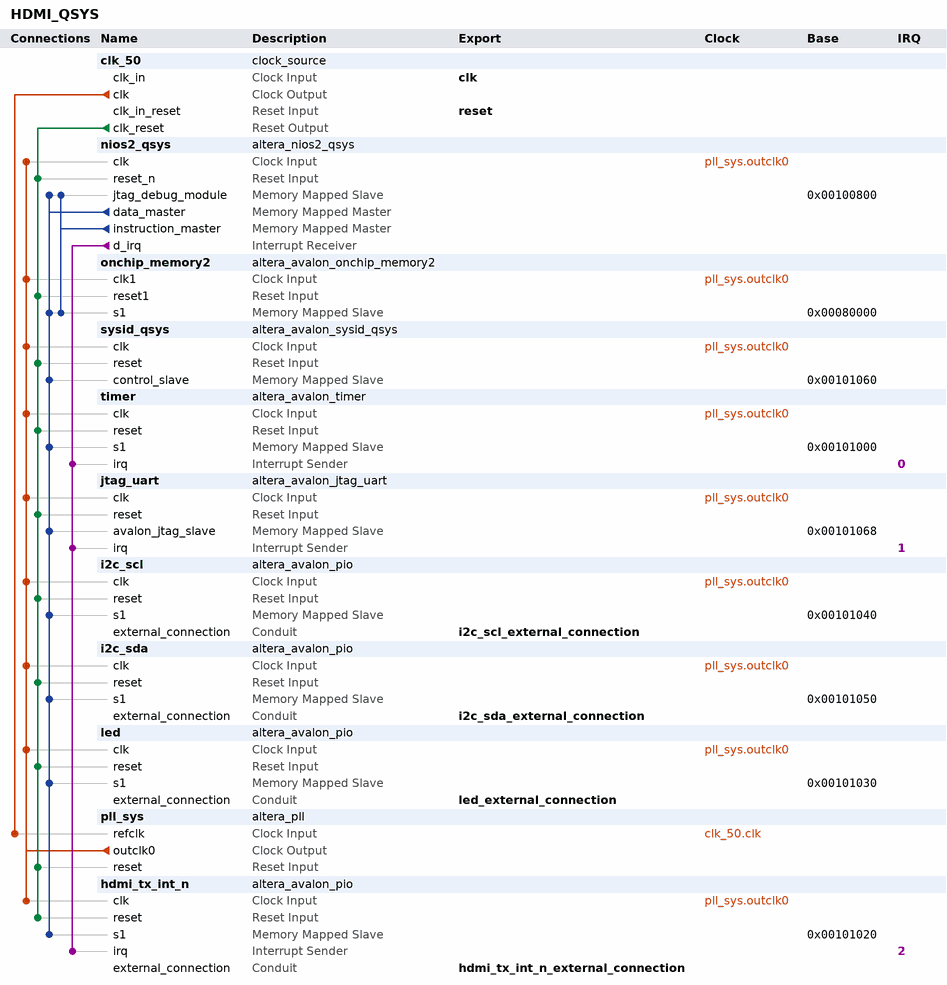
[diagram p0: system contents]
# Platform Designer (Qsys) system HDMI_QSYS, Cyclone V 5CGXFC5C6F27C7
# Parameters at their usual value, and those the tool derives, are not listed.
package require -exact qsys 13.0.1
create_system HDMI_QSYS
set_project_property DEVICE_FAMILY {Cyclone V}
set_project_property DEVICE 5CGXFC5C6F27C7

add_instance clk_50 clock_source 13.0
set_instance_parameter_value clk_50 clockFrequency 50000000

add_instance nios2_qsys altera_nios2_qsys 13.0
set_instance_parameter_value nios2_qsys resetSlave onchip_memory2.s1
set_instance_parameter_value nios2_qsys exceptionSlave onchip_memory2.s1
set_instance_parameter_value nios2_qsys breakSlave nios2_qsys.jtag_debug_module
set_instance_parameter_value nios2_qsys impl Fast
set_instance_parameter_value nios2_qsys icache_size 4096

add_instance onchip_memory2 altera_avalon_onchip_memory2 13.0.1
set_instance_parameter_value onchip_memory2 dataWidth 32
set_instance_parameter_value onchip_memory2 dualPort false
set_instance_parameter_value onchip_memory2 initMemContent true
set_instance_parameter_value onchip_memory2 initializationFileName onchip_memory2
set_instance_parameter_value onchip_memory2 memorySize 310000

add_instance sysid_qsys altera_avalon_sysid_qsys 13.0
set_instance_parameter_value sysid_qsys id 0

add_instance timer altera_avalon_timer 13.0.1
set_instance_parameter_value timer period 1
set_instance_parameter_value timer periodUnits MSEC

add_instance jtag_uart altera_avalon_jtag_uart 13.0.1
set_instance_parameter_value jtag_uart simInteractiveOptions INTERACTIVE_ASCII_OUTPUT

add_instance i2c_scl altera_avalon_pio 13.0.1
set_instance_parameter_value i2c_scl direction Output
set_instance_parameter_value i2c_scl resetValue 1
set_instance_parameter_value i2c_scl width 1

add_instance i2c_sda altera_avalon_pio 13.0.1
set_instance_parameter_value i2c_sda direction Bidir
set_instance_parameter_value i2c_sda resetValue 1
set_instance_parameter_value i2c_sda width 1

add_instance led altera_avalon_pio 13.0.1
set_instance_parameter_value led direction Output
set_instance_parameter_value led width 8

add_instance pll_sys altera_pll 13.0
set_instance_parameter_value pll_sys gui_device_speed_grade 2
set_instance_parameter_value pll_sys gui_pll_mode {Integer-N PLL}
set_instance_parameter_value pll_sys gui_reference_clock_frequency 50.0
set_instance_parameter_value pll_sys gui_operation_mode normal
set_instance_parameter_value pll_sys gui_use_locked true
set_instance_parameter_value pll_sys gui_number_of_clocks 1
set_instance_parameter_value pll_sys gui_output_clock_frequency0 50.0

add_instance hdmi_tx_int_n altera_avalon_pio 13.0.1
set_instance_parameter_value hdmi_tx_int_n bitClearingEdgeCapReg true
set_instance_parameter_value hdmi_tx_int_n captureEdge true
set_instance_parameter_value hdmi_tx_int_n direction Input
set_instance_parameter_value hdmi_tx_int_n edgeType FALLING
set_instance_parameter_value hdmi_tx_int_n generateIRQ true
set_instance_parameter_value hdmi_tx_int_n width 1

# connections
add_connection clk_50.clk pll_sys.refclk clock
add_connection pll_sys.outclk0 hdmi_tx_int_n.clk clock
add_connection pll_sys.outclk0 i2c_scl.clk clock
add_connection pll_sys.outclk0 i2c_sda.clk clock
add_connection pll_sys.outclk0 jtag_uart.clk clock
add_connection pll_sys.outclk0 led.clk clock
add_connection pll_sys.outclk0 nios2_qsys.clk clock
add_connection pll_sys.outclk0 onchip_memory2.clk1 clock
add_connection pll_sys.outclk0 sysid_qsys.clk clock
add_connection pll_sys.outclk0 timer.clk clock
add_connection clk_50.clk_reset hdmi_tx_int_n.reset reset
add_connection clk_50.clk_reset i2c_scl.reset reset
add_connection clk_50.clk_reset i2c_sda.reset reset
add_connection clk_50.clk_reset jtag_uart.reset reset
add_connection clk_50.clk_reset led.reset reset
add_connection clk_50.clk_reset nios2_qsys.reset_n reset
add_connection clk_50.clk_reset onchip_memory2.reset1 reset
add_connection clk_50.clk_reset pll_sys.reset reset
add_connection clk_50.clk_reset sysid_qsys.reset reset
add_connection clk_50.clk_reset timer.reset reset
add_connection nios2_qsys.data_master hdmi_tx_int_n.s1 avalon
set_connection_parameter_value nios2_qsys.data_master/hdmi_tx_int_n.s1 baseAddress 0x00101020
add_connection nios2_qsys.data_master i2c_scl.s1 avalon
set_connection_parameter_value nios2_qsys.data_master/i2c_scl.s1 baseAddress 0x00101040
add_connection nios2_qsys.data_master i2c_sda.s1 avalon
set_connection_parameter_value nios2_qsys.data_master/i2c_sda.s1 baseAddress 0x00101050
add_connection nios2_qsys.data_master jtag_uart.avalon_jtag_slave avalon
set_connection_parameter_value nios2_qsys.data_master/jtag_uart.avalon_jtag_slave baseAddress 0x00101068
add_connection nios2_qsys.data_master led.s1 avalon
set_connection_parameter_value nios2_qsys.data_master/led.s1 baseAddress 0x00101030
add_connection nios2_qsys.data_master nios2_qsys.jtag_debug_module avalon
set_connection_parameter_value nios2_qsys.data_master/nios2_qsys.jtag_debug_module baseAddress 0x00100800
add_connection nios2_qsys.data_master onchip_memory2.s1 avalon
set_connection_parameter_value nios2_qsys.data_master/onchip_memory2.s1 baseAddress 0x00080000
add_connection nios2_qsys.data_master sysid_qsys.control_slave avalon
set_connection_parameter_value nios2_qsys.data_master/sysid_qsys.control_slave baseAddress 0x00101060
add_connection nios2_qsys.data_master timer.s1 avalon
set_connection_parameter_value nios2_qsys.data_master/timer.s1 baseAddress 0x00101000
add_connection nios2_qsys.instruction_master nios2_qsys.jtag_debug_module avalon
set_connection_parameter_value nios2_qsys.instruction_master/nios2_qsys.jtag_debug_module baseAddress 0x00100800
add_connection nios2_qsys.instruction_master onchip_memory2.s1 avalon
set_connection_parameter_value nios2_qsys.instruction_master/onchip_memory2.s1 baseAddress 0x00080000
add_connection nios2_qsys.d_irq hdmi_tx_int_n.irq interrupt
set_connection_parameter_value nios2_qsys.d_irq/hdmi_tx_int_n.irq irqNumber 2
add_connection nios2_qsys.d_irq jtag_uart.irq interrupt
set_connection_parameter_value nios2_qsys.d_irq/jtag_uart.irq irqNumber 1
add_connection nios2_qsys.d_irq timer.irq interrupt
set_connection_parameter_value nios2_qsys.d_irq/timer.irq irqNumber 0

# exported interfaces
add_interface reset reset sink
set_interface_property reset EXPORT_OF clk_50.clk_in_reset
add_interface led_external_connection conduit end
set_interface_property led_external_connection EXPORT_OF led.external_connection
add_interface i2c_sda_external_connection conduit end
set_interface_property i2c_sda_external_connection EXPORT_OF i2c_sda.external_connection
add_interface i2c_scl_external_connection conduit end
set_interface_property i2c_scl_external_connection EXPORT_OF i2c_scl.external_connection
add_interface hdmi_tx_int_n_external_connection conduit end
set_interface_property hdmi_tx_int_n_external_connection EXPORT_OF hdmi_tx_int_n.external_connection
add_interface clk clock sink
set_interface_property clk EXPORT_OF clk_50.clk_in

set_interconnect_requirement {$system} qsys_mm.clockCrossingAdapter HANDSHAKE
set_interconnect_requirement {$system} qsys_mm.maxAdditionalLatency 1

save_system HDMI_QSYS.qsys
